# Altium schematic sheet Sheet3.SchDoc
size A4
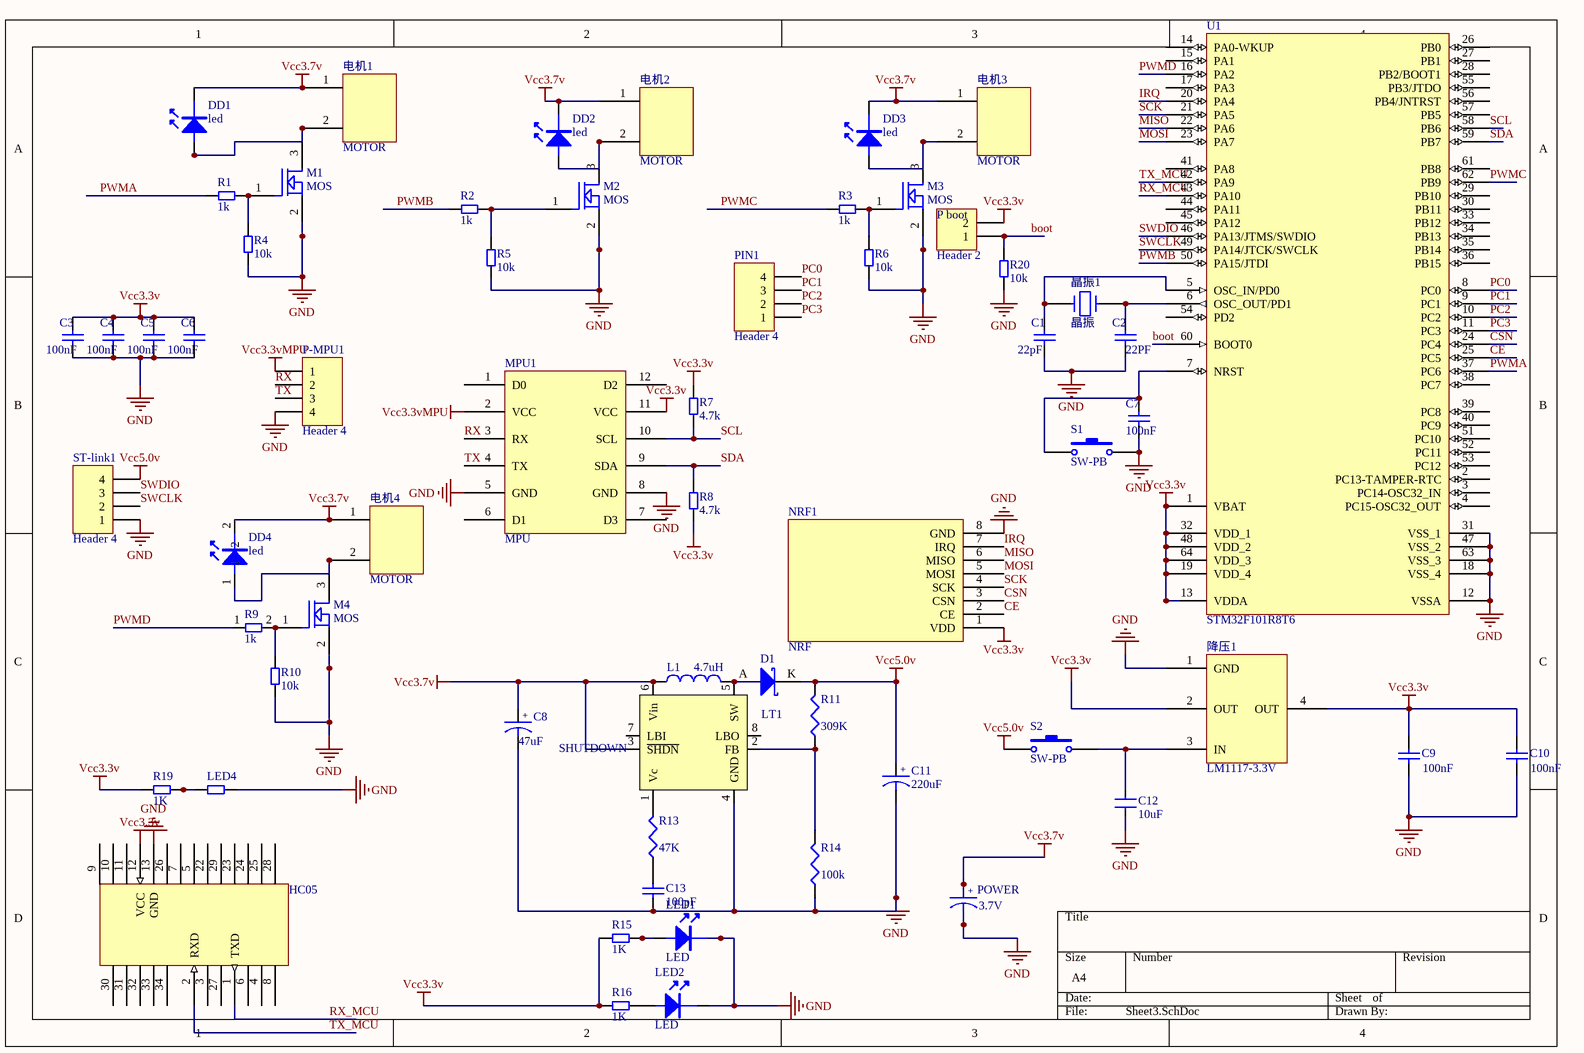
[diagram p0: Sheet3.SchDoc]

## Parts
C1  22pF  [0805C]
C2  22PF  [0805C]
C3  100nF  [0805C]
C4  100nF  [0805C]
C5  100nF  [0805C]
C6  100nF  [0805C]
C7  100nF  [0805C]
C8  value 47uF  [5*5.5]
C9  value 100nF  [0805C]  (hidden comment: Cap)
C10  value 100nF  [0805C]  (hidden comment: Cap)
C11  220uF  [6.3*7]
C12  10uF  [0805C]
C13  100pF  [0805C]
D1  (no value)  [SMA]
DD1  led  [0805d]
DD2  led  [0805d]
DD3  led  [0805d]
DD4  led  [0805d]
HC05  (no value)  [HC05]
L1  value 4.7uH  [7*7*4]
LED1  LED  [RB.1/.2]
LED2  LED  [RB.1/.2]
LED4  (no value)  [0805d]
LT1  LT1308  [SO-8]  (value not drawn)
M1  MOS  [mos]
M2  MOS  [mos]
M3  MOS  [mos]
M4  MOS  [mos]
MPU1  MPU  [MPU]
NRF1  NRF  [nrf]
P-MPU1  Header 4  [HDR1X4]
P_boot  Header 2  [HDR1X2]
PIN1  Header 4  [HDR1X4]
POWER  3.7V  [6.3*7]
R1  1k  [0805R]
R2  1k  [0805R]
R3  1k  [0805R]
R4  10k  [0805R]
R5  10k  [0805R]
R6  10k  [0805R]
R7  4.7k  [0805R]
R8  4.7k  [0805R]
R9  1k  [0805R]
R10  10k  [0805R]
R11  value 309K  [0805R]
R13  value 47K  [0805R]
R14  value 100k  [0805R]
R15  1K  [0805r]
R16  1K  [0805R]
R19  1K  [0805r]
R20  10k  [0805R]
S1  SW-PB  [key]
S2  SW-PB  [总开关]
ST-link1  Header 4  [HDR1X4]
U1  STM32F101R8T6  [LQFP64_N]  (net tie)
晶振1  晶振  [LC-HC-49SMD]
电机1  MOTOR  [motor hanpan]
电机2  MOTOR  [motor hanpan]
电机3  MOTOR  [motor hanpan]
电机4  MOTOR  [motor hanpan]
降压1  LM1117-3.3V  [SOT223]

## Nets
GND: C1.1 C2.1 C3.1 C4.1 C5.1 C6.1 C7.1 C8.2 C9.1 C10.1 C11.2 C12.2 C13.1 HC05.13(GND) LED1.2 LED2.2 LED4.2 LT1.4(GND) M1.2 M2.2 M3.2 M4.2 MPU1.5(GND) MPU1.8(GND) NRF1.8(GND) P-MPU1.4 POWER.2 R4.1 R5.1 R6.1 R10.1 R14.1 R20.1 S1.2 ST-link1.1 U1.12(VSSA) U1.18(VSS_4) U1.31(VSS_1) U1.47(VSS_2) U1.63(VSS_3) 降压1.1(GND)
Vcc3.3v: C3.2 C4.2 C5.2 C6.2 C9.2 C10.2 HC05.12(VCC) MPU1.11(VCC) NRF1.1(VDD) P_boot.2 R7.2 R8.1 R15.1 R16.1 R19.1 U1.1(VBAT) U1.13(VDDA) U1.19(VDD_4) U1.32(VDD_1) U1.48(VDD_2) U1.64(VDD_3) 降压1.2(OUT) 降压1.4(OUT)
Vcc3.3vMPU: MPU1.2(VCC) P-MPU1.1
Vcc3.7v: C8.1 DD1.2 DD2.2 DD3.2 DD4.2 L1.1 LT1.3(~{SHDN}) LT1.6(Vin) POWER.1 电机1.1 电机2.1 电机3.1 电机4.1
Vcc5.0v: C11.1 D1.K R11.2 S2.1 ST-link1.4
boot: P_boot.1 R20.2 U1.60(BOOT0)
CE: NRF1.2(CE) U1.25(PC5)
CSN: NRF1.3(CSN) U1.24(PC4)
IRQ: NRF1.7(IRQ) U1.20(PA4)
MISO: NRF1.6(MISO) U1.22(PA6)
MOSI: NRF1.5(MOSI) U1.23(PA7)
PC0: PIN1.4 U1.8(PC0)
PC1: PIN1.3 U1.9(PC1)
PC2: PIN1.2 U1.10(PC2)
PC3: PIN1.1 U1.11(PC3)
PWMA: R1.1 U1.37(PC6)
PWMB: R2.1 U1.50(PA15/JTDI)
PWMC: R3.1 U1.62(PB9)
PWMD: R9.1 U1.16(PA2)
RX: MPU1.3(RX) P-MPU1.2
RX_MCU: HC05.1(TXD) U1.43(PA10)
SCK: NRF1.4(SCK) U1.21(PA5)
SCL: MPU1.10(SCL) R7.1 U1.58(PB6)
SDA: MPU1.9(SDA) R8.2 U1.59(PB7)
SWCLK: ST-link1.2 U1.49(PA14/JTCK/SWCLK)
SWDIO: ST-link1.3 U1.46(PA13/JTMS/SWDIO)
TX: MPU1.4(TX) P-MPU1.3
TX_MCU: HC05.2(RXD) U1.42(PA9)
NetC1_2: C1.2 U1.5(OSC_IN/PD0) 晶振1.1
NetC2_2: C2.2 U1.6(OSC_OUT/PD1) 晶振1.2
NetC7_2: C7.2 S1.1 U1.7(NRST)
NetC12_1: C12.1 S2.2 降压1.3(IN)
NetC13_2: C13.2 R13.1
NetD1_A: D1.A L1.2 LT1.5(SW)
NetDD1_1: DD1.1 M1.3 电机1.2
NetDD2_1: DD2.1 M2.3 电机2.2
NetDD3_1: DD3.1 M3.3 电机3.2
NetDD4_1: DD4.1 M4.3 电机4.2
NetLED1_1: LED1.1 R15.2
NetLED2_1: LED2.1 R16.2
NetLED4_1: LED4.1 R19.2
NetLT1_1: LT1.1(Vc) R13.2
NetLT1_2: LT1.2(FB) R11.1 R14.2
NetM1_1: M1.1 R1.2 R4.2
NetM2_1: M2.1 R2.2 R5.2
NetM3_1: M3.1 R3.2 R6.2
NetM4_1: M4.1 R9.2 R10.2

Not connected (* = marked no-connect by the designer): HC05 3 4 5 6 7 8 9 10 11 22 23 24 25 26 27 28 29 30 31 32 33 34; LT1 7(LBI) 8(LBO); MPU1 1(D0) 6(D1) 7(D3) 12(D2); U1 2(PC13-TAMPER-RTC) 3(PC14-OSC32_IN) 4(PC15-OSC32_OUT) 14(PA0-WKUP) 15(PA1) 17(PA3) 26(PB0) 27(PB1) 28(PB2/BOOT1) 29(PB10) 30(PB11) 33(PB12) 34(PB13) 35(PB14) 36(PB15) 38(PC7) 39(PC8) 40(PC9) 41(PA8) 44(PA11) 45(PA12) 51(PC10) 52(PC11) 53(PC12) 54(PD2) 55(PB3/JTDO) 56(PB4/JNTRST) 57(PB5) 61(PB8)

## Notes on the sheet
- SHUTDOWN
- (in symbol CAP-T) +

## Library data of the parts
C1-C7 C13 = 陶瓷电容
C8 C11 POWER = CAP-T: 钽电容
C9 C10 = Cap: Capacitor; Published: 8-Jun-2000; LatestRevisionDate: 17-Jul-2002; LatestRevisionNote: Re-released for DXP Platform.; PackageReference: RAD-0.3; Publisher: Altium Limited
C12 = C_0.1uF: SMD-CAP
D1 = Diode 11DQ03: Schottky Rectifier; Published: 8-Jun-2000; LatestRevisionDate: 17-Jul-2002; LatestRevisionNote: Re-released for DXP Platform.; DatasheetVersion: Dec-1997; PackageReference: DO-204AL; Publisher: Altium Limited; PackageDescription: Diode, Axial; Body 5.2 x 2.7 mm (LxDia. max), Lead Dia. 0.86 mm (max); Code_JEDEC: DO-204-AL; ComponentLink1Description: Manufacturer Link; ComponentLink1URL: http://www.irf.com/; ComponentLink2Description: Datasheet; ComponentLink2URL: http://www.irf.com/product-info/datasheets/data/11dq03.pdf
HC05 = HC05
L1 = Inductor: Code_IEC: 1005; Published: 8-Jun-2000; LatestRevisionDate: 29-May-2009; LatestRevisionNote: IPC-7351 Footprint Added.; PackageReference: 0402-A; Publisher: Altium Limited; PackageDescription: Chip Inductor; Code_JEITA: 0402
LED1 LED2 = LED: LED发光管
LED4 R1-R10 R15 R16 R19 = R: 电阻
MPU1 = mpu9250
NRF1 = Component_2.nrf
P-MPU1 PIN1 ST-link1 = Header 4: Header, 4-Pin; LatestRevisionDate: 17-Jul-2002; LatestRevisionNote: Re-released for DXP Platform.; Publisher: Altium Limited
P_boot = Header 2: Header, 2-Pin; LatestRevisionDate: 17-Jul-2002; LatestRevisionNote: Re-released for DXP Platform.; Publisher: Altium Limited
R11 R13 R14 = Res3: Resistor; Published: 8-Jun-2000; LatestRevisionDate: 29-May-2009; LatestRevisionNote: IPC-7351 Footprint Added.; PackageReference: J1-0603; Publisher: Altium Limited; PackageDescription: Chip Resistor
R20 = R
S1 S2 = SW-PB: Switch; Published: 24-Mar-1999; LatestRevisionDate: 17-Jul-2002; LatestRevisionNote: Re-released for DXP Platform.; PackageReference: SPST-2; Publisher: Altium Limited
U1 = STM32F101R8T6: STM32 ARM-based 32-bit MCU with 64 Kbytes Flash, 64-pin LQFP, Industrial Temperature; Published: 30-May-2008; DatasheetVersion: rev6, Mar-2008; PackageVersion: Mar-2008; PackageReference: LQFP64; Publisher: Altium Limited; PackageDescription: 64-Pin Low-Profile Quad Flat Pack, 10 x 10 mm Body, 0.5 mm Pitch (LQFP64); ComponentLink1Description: Manufacturer Link; ComponentLink1URL: www.st.com/stm32; ComponentLink2Description: Datasheet; ComponentLink2URL: http://www.st.com/stonline/products/literature/ds/13586.pdf
降压1 = Component_1